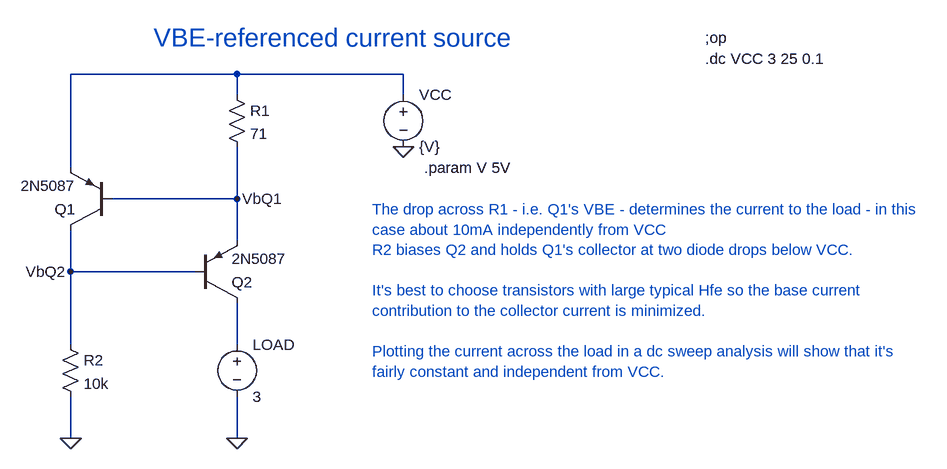
[diagram p0: schematic Figure2.25.asc]
Figure2.25.asc, the LTspice schematic file:
Version 4
SHEET 1 2008 680
WIRE 320 -96 64 -96
WIRE 576 -96 320 -96
WIRE 320 -64 320 -96
WIRE 576 -64 576 -96
WIRE 64 48 64 -96
WIRE 320 96 320 16
WIRE 320 96 128 96
WIRE 320 160 320 96
WIRE 64 208 64 144
WIRE 256 208 64 208
WIRE 64 320 64 208
WIRE 320 320 320 256
WIRE 64 464 64 400
WIRE 320 464 320 400
FLAG 576 16 0
FLAG 64 464 0
FLAG 320 464 0
FLAG 320 96 VbQ1
FLAG 64 208 VbQ2
SYMBOL pnp 256 256 M180
SYMATTR InstName Q2
SYMATTR Value 2N5087
SYMBOL pnp 128 144 R180
SYMATTR InstName Q1
SYMATTR Value 2N5087
SYMBOL res 304 -80 R0
SYMATTR InstName R1
SYMATTR Value 71
SYMBOL res 48 304 R0
SYMATTR InstName R2
SYMATTR Value 10k
SYMBOL voltage 576 -80 R0
WINDOW 123 0 0 Left 0
WINDOW 39 0 0 Left 0
SYMATTR InstName VCC
SYMATTR Value {V}
SYMBOL voltage 320 304 R0
WINDOW 123 0 0 Left 0
WINDOW 39 0 0 Left 0
SYMATTR InstName LOAD
SYMATTR Value 3
TEXT 1040 -152 Left 2 !;op
TEXT 192 -152 Left 4 ;VBE-referenced current source
TEXT 608 48 Left 2 !.param V 5V
TEXT 1040 -120 Left 2 !.dc VCC 3 25 0.1
TEXT 528 112 Left 2 ;The drop across R1 - i.e. Q1's VBE - determines the current to the load - in this \ncase about 10mA independently from VCC\nR2 biases Q2 and holds Q1's collector at two diode drops below VCC.\n \nIt's best to choose transistors with large typical Hfe so the base current\ncontribution to the collector current is minimized.\n \nPlotting the current across the load in a dc sweep analysis will show that it's\nfairly constant and independent from VCC.

The netlist it stands for:
* Figure2.25.asc
Q2 N002 VbQ2 VbQ1 0 2N5087
Q1 VbQ2 VbQ1 N001 0 2N5087
R1 N001 VbQ1 71
R2 VbQ2 0 10k
VCC N001 0 {V}
V§LOAD N002 0 3
.model NPN NPN
.model PNP PNP
.lib standard.bjt
;op
* VBE-referenced current source
.param V 5V
.dc VCC 3 25 0.1
* The drop across R1 - i.e. Q1's VBE - determines the current to the load - in this
* case about 10mA independently from VCC
* R2 biases Q2 and holds Q1's collector at two diode drops below VCC.
* It's best to choose transistors with large typical Hfe so the base current
* contribution to the collector current is minimized.
* Plotting the current across the load in a dc sweep analysis will show that it's
* fairly constant and independent from VCC.
.backanno
.end